# Altium schematic sheet filter.SchDoc
size A
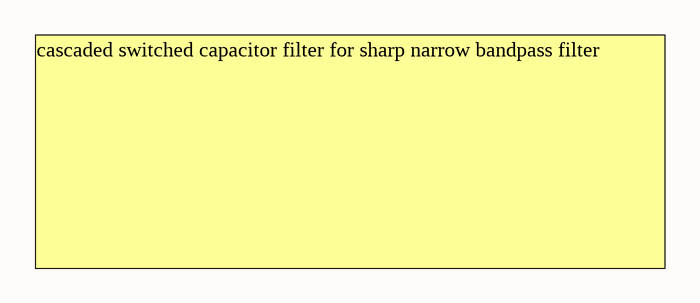
[diagram p0: filter.SchDoc]

## Notes on the sheet
- cascaded switched capacitor filter for sharp narrow bandpass filter